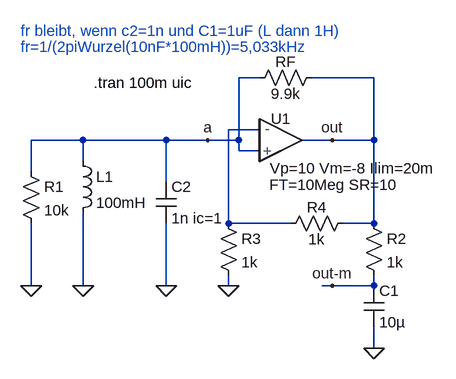
[diagram p0: schematic LC-osc-mit-neg-R.asc]
LC-osc-mit-neg-R.asc, the LTspice schematic file:
Version 4
SHEET 1 1072 680
WIRE -144 112 -176 112
WIRE 32 112 -64 112
WIRE -144 192 -192 192
WIRE -416 208 -496 208
WIRE -288 208 -416 208
WIRE -224 208 -288 208
WIRE -176 208 -176 112
WIRE -176 208 -224 208
WIRE -32 208 -80 208
WIRE 32 208 32 112
WIRE 32 208 -32 208
WIRE -176 224 -176 208
WIRE -144 224 -176 224
WIRE -416 240 -416 208
WIRE -496 256 -496 208
WIRE -288 272 -288 208
WIRE -192 336 -192 192
WIRE -96 336 -192 336
WIRE 32 336 32 208
WIRE 32 336 -16 336
WIRE -496 432 -496 336
WIRE -416 432 -416 320
WIRE -288 432 -288 336
WIRE -192 432 -192 416
WIRE -32 432 -48 432
WIRE 32 432 32 416
WIRE 32 432 -32 432
WIRE 32 528 32 496
FLAG -224 208 a
FLAG -192 432 0
FLAG -288 432 0
FLAG -416 432 0
FLAG -496 432 0
FLAG -32 208 out
FLAG 32 528 0
FLAG -32 432 out-m
SYMBOL cap -304 272 R0
SYMATTR InstName C2
SYMATTR Value 1n ic=1
SYMBOL res -208 320 R0
SYMATTR InstName R3
SYMATTR Value 1k
SYMBOL res 0 320 R90
WINDOW 0 7 56 VBottom 2
WINDOW 3 25 56 VTop 2
SYMATTR InstName R4
SYMATTR Value 1k
SYMBOL res -48 96 R90
WINDOW 0 7 56 VBottom 2
WINDOW 3 25 56 VTop 2
SYMATTR InstName RF
SYMATTR Value 9.9k
SYMBOL ind -432 224 R0
SYMATTR InstName L1
SYMATTR Value 100mH
SYMBOL res -512 240 R0
SYMATTR InstName R1
SYMATTR Value 10k
SYMBOL EIT_Semiconductors\\op_3 -112 208 R0
SYMATTR InstName U1
SYMATTR Value Vp=10 Vm=-8 Ilim=20m
SYMBOL res 16 320 R0
SYMATTR InstName R2
SYMATTR Value 1k
SYMBOL cap 16 432 R0
SYMATTR InstName C1
SYMATTR Value 10µ
TEXT -400 120 Left 2 !.tran 100m uic
TEXT -512 64 Left 2 ;fr=1/(2piWurzel(10nF*100mH))=5,033kHz
TEXT -512 40 Left 2 ;fr bleibt, wenn c2=1n und C1=1uF (L dann 1H)

The netlist it stands for:
* LC-osc-mit-neg-R.asc
C2 a 0 1n ic=1
R3 N001 0 1k
R4 out N001 1k
RF out a 9.9k
L1 a 0 100mH
R1 a 0 10k
XU1 a N001 out opamp_param_3 Vp=10 Vm=-8 Ilim=20m FT=10Meg SR=10 Vos=0 A0=100k phir=45 en=0 enk=0 in=0 ink=0 Rin=500Meg  ; pins In+ In- OUT
R2 out out-m 1k
C1 out-m 0 10µ
.tran 100m uic
* fr=1/(2piWurzel(10nF*100mH))=5,033kHz
* fr bleibt, wenn c2=1n und C1=1uF (L dann 1H)
.lib EIT_sub\opamp_parametrierbar.sub
.backanno
.end